# Altium schematic sheet Power.SchDoc
size A; SheetNumber: 2; SheetTotal: 2
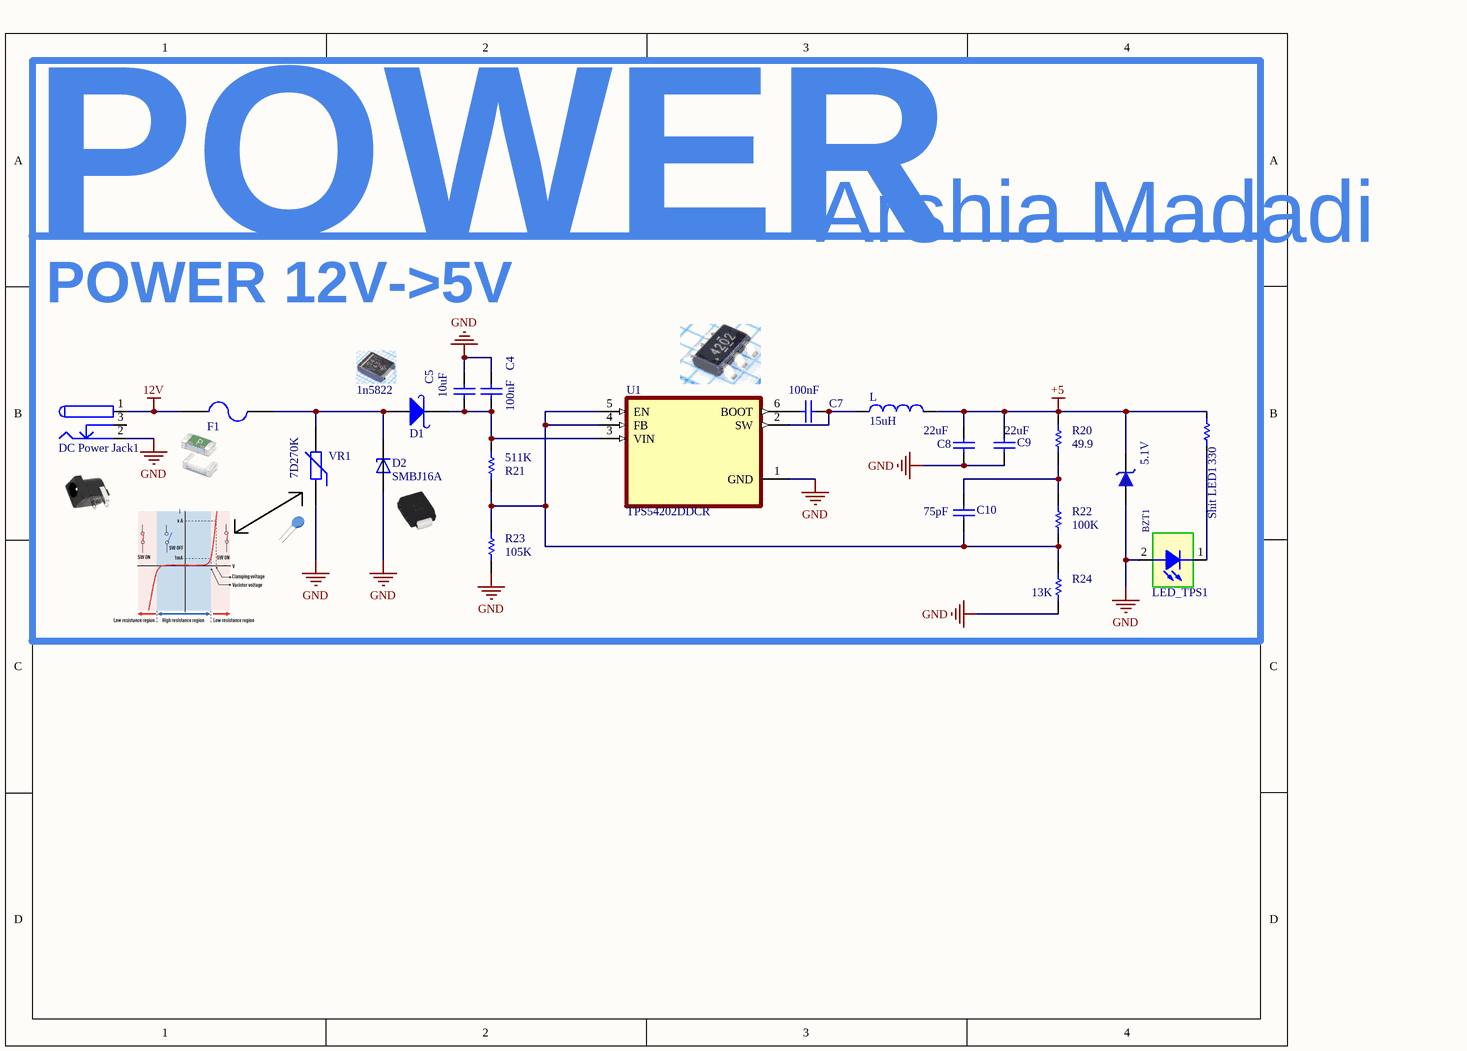
[diagram p0: Power.SchDoc]

## Parts
BZT1  5.1V  [SOD123]
C4  100nF  [CAPC4817X12N]
C5  10uF  [CAPC4817X12N]
C7  100nF  [CAPC4817X12N]
C8  22uF  [CAPC4817X12N]
C9  22uF  [CAPC4817X12N]
C10  75pF  [CAPC4817X12N]
D1  1n5822  [DO-214AB(SMC)]
D2  SMBJ16A  [DIOM4336X265N]
DC_Power_Jack1  DC Power Jack  [DC Power Jack 1]  (value not drawn)
F1  F=3.0 A  [1206 FUSE]  (value not drawn)
L  15uH  [IND1206]
LED_TPS1  SMD 1206 LED  [LED 1206]  (value not drawn)
R20  49.9  [RESC4817X04N]
R21  511K  [RESC4817X04N]
R22  100K  [RESC4817X04N]
R23  105K  [RESC4817X04N]
R24  13K  [RESC4817X04N]
Shit_LED1  330  [1206_Res]
U1  TPS54202DDCR  [SOT95P280X110-6N]
VR1  7D270K  [07D XXX]

## Nets
12V: DC_Power_Jack1.1 F1.1
+5: BZT1.2 C8.2 C9.2 L.2 R20.2 Shit_LED1.2
GND: BZT1.1 C4.2 C5.2 C8.1 C9.1 D2.A DC_Power_Jack1.2 LED_TPS1.2 R23.1 R24.1 U1.1(GND) VR1.1
NetC4_1: C4.1 C5.1 D1.2(K) R21.2 U1.3(VIN)
NetC7_1: C7.1 U1.6(BOOT)
NetC7_2: C7.2 L.1 U1.2(SW)
NetC10_1: C10.1 R21.1 R22.1 R23.2 R24.2 U1.4(FB) U1.5(EN)
NetC10_2: C10.2 R20.1 R22.2
NetD1_1: D1.1(A) D2.C F1.2 VR1.2
NetLED_TPS1_1: LED_TPS1.1 Shit_LED1.1

Not connected (* = marked no-connect by the designer): DC_Power_Jack1 3

## Notes on the sheet
- Arshia Madadi
- POWER
- POWER 12V->5V

## Library data of the parts
BZT1 = ZENER GENERAL DIODE: DIODE ZENER GENERAL; VALUE: 12V; Published: 2017-1-12; PackageVersion: 2017-1-12; PackageReference: DO 35; Publisher: Abbas Basereh; PackageDescription: DIODE GEN ZENER; ComponentLink1Description: Manufacturer Link; ComponentLink2Description: Datasheet
C4 C5 C7-C10 = CAP SMD 1206: CAP 1206; Designer: Abbas Basereh; Desc.: CAP SMD 1206; Data: 16-12-2016
D1 = 1N5822 SMD: Schottky Rectifiers; Part. No: SS34; Manufacturer: ON Semiconductor/Fairchild; Designer: Abbas Basereh; Link: https://www.aliexpress.com/item/Free-shipping-100pcs-1n5822-sma-smd-do-214ac-Schottky-diode-ss34/32337482329.html?spm=2114.01010208.3.1.zLZDsP&ws_ab_test=searchweb0_0,searchweb201602_4_10065_10068_10084_10083_10080_10082_10081_10060_10061_10062_10056_10055_10054_10059_10099_10078_10079_427_10073_10103_10102_10096_10052_10050_10051,searchweb201603_4&btsid=6e50dc92-ac69-45bc-a19e-209af19ce602; Link: http://www.tme.eu/en/details/ss34/smd-schottky-diodes/vishay/ss34-e357t/; Link: http://www.digikey.com/product-detail/en/on-semiconductor-fairchild/SS34/SS34FSCT-ND/2094459; Data: 16-12-2016
D2 = SMBJ16A: 600W, 18.8V, 5%, Unidirectional, TVS; MF: Taiwan Semiconductor; MP: SMBJ16A; SnapEDA_Link: https://www.snapeda.com/parts/SMBJ16A/Taiwan+Semiconductor/view-part/?ref=snap; Check_prices: https://www.snapeda.com/parts/SMBJ16A/Taiwan+Semiconductor/view-part/?ref=eda; Price: None; Availability: In Stock; Purchase-URL: https://pricing.snapeda.com/search/part/SMBJ16A/?ref=eda; Package: SMD-2-2 Avago; Value: *
DC_Power_Jack1 = DC Power Jack: DC Power Jack. Center Pin 2.5mm. Diameter: 5.7mm; Designer: Ali Hafizi; Company: Personal; Project Name: Laser; Adding Date: 10/21/2009
F1 = Fuse SMD1206: SMD Fuses 1206; Designer: Abbas Basereh; Desc.: SMD Fuses 1206; Data: 16-12-2016
L = INDUCTOR SMD PACKAGE: TOTAL INDUCTOR SMD PACK; Designer: Abbas Basereh; Desc.: INDUCTOR  SMD TOTAL PACKAGES; VALUE: 1u; Data: 2017-3-10
LED_TPS1 = LED SMD 1206
R20-R24 = RES 1206 0.25W: RES 1206; Designer: Abbas Basereh; Desc.: RES SMD 1206; Data: 16-12-2016
Shit_LED1 = Res: Resistor; Published: 8-Jun-2000; LatestRevisionDate: 17-Jul-2002; LatestRevisionNote: Re-released for DXP Platform.; PackageReference: AXIAL-0.3; Publisher: Altium Limited
U1 = TPS54202DDCR: 4.5V to 28V Input, 2A Output, EMI Friendly Synchronous Step-Down Converter 6-SOT-23-THIN -40 to 125; MF: Texas Instruments; Price: None; Value: *; Texas_Instruments-Purchase-URL: https://snapeda.com/shop?store=Texas+Instruments&id=565860; Mouser-Purchase-URL: https://snapeda.com/shop?store=Mouser&id=565860; Package: SOT-23-THN-6 Texas Instruments; SnapEDA_Link: https://www.snapeda.com/parts/TPS54202DDCR/Texas%20Instruments/view-part/565860/?ref=snap; Availability: Good; MP: TPS54202DDCR; DigiKey-Purchase-URL: https://snapeda.com/shop?store=DigiKey&id=565860
VR1 = VARISTOR (VDR): VARISTORS; Manufacturer: china-canada-philipina; Designer: Abbas Basereh; VALUE: xxDxxx; Models: MOV-VDR-COV; Data: 2017-1-5; Link: digikey.com; PUBLISHER: ABBAS BASEREH